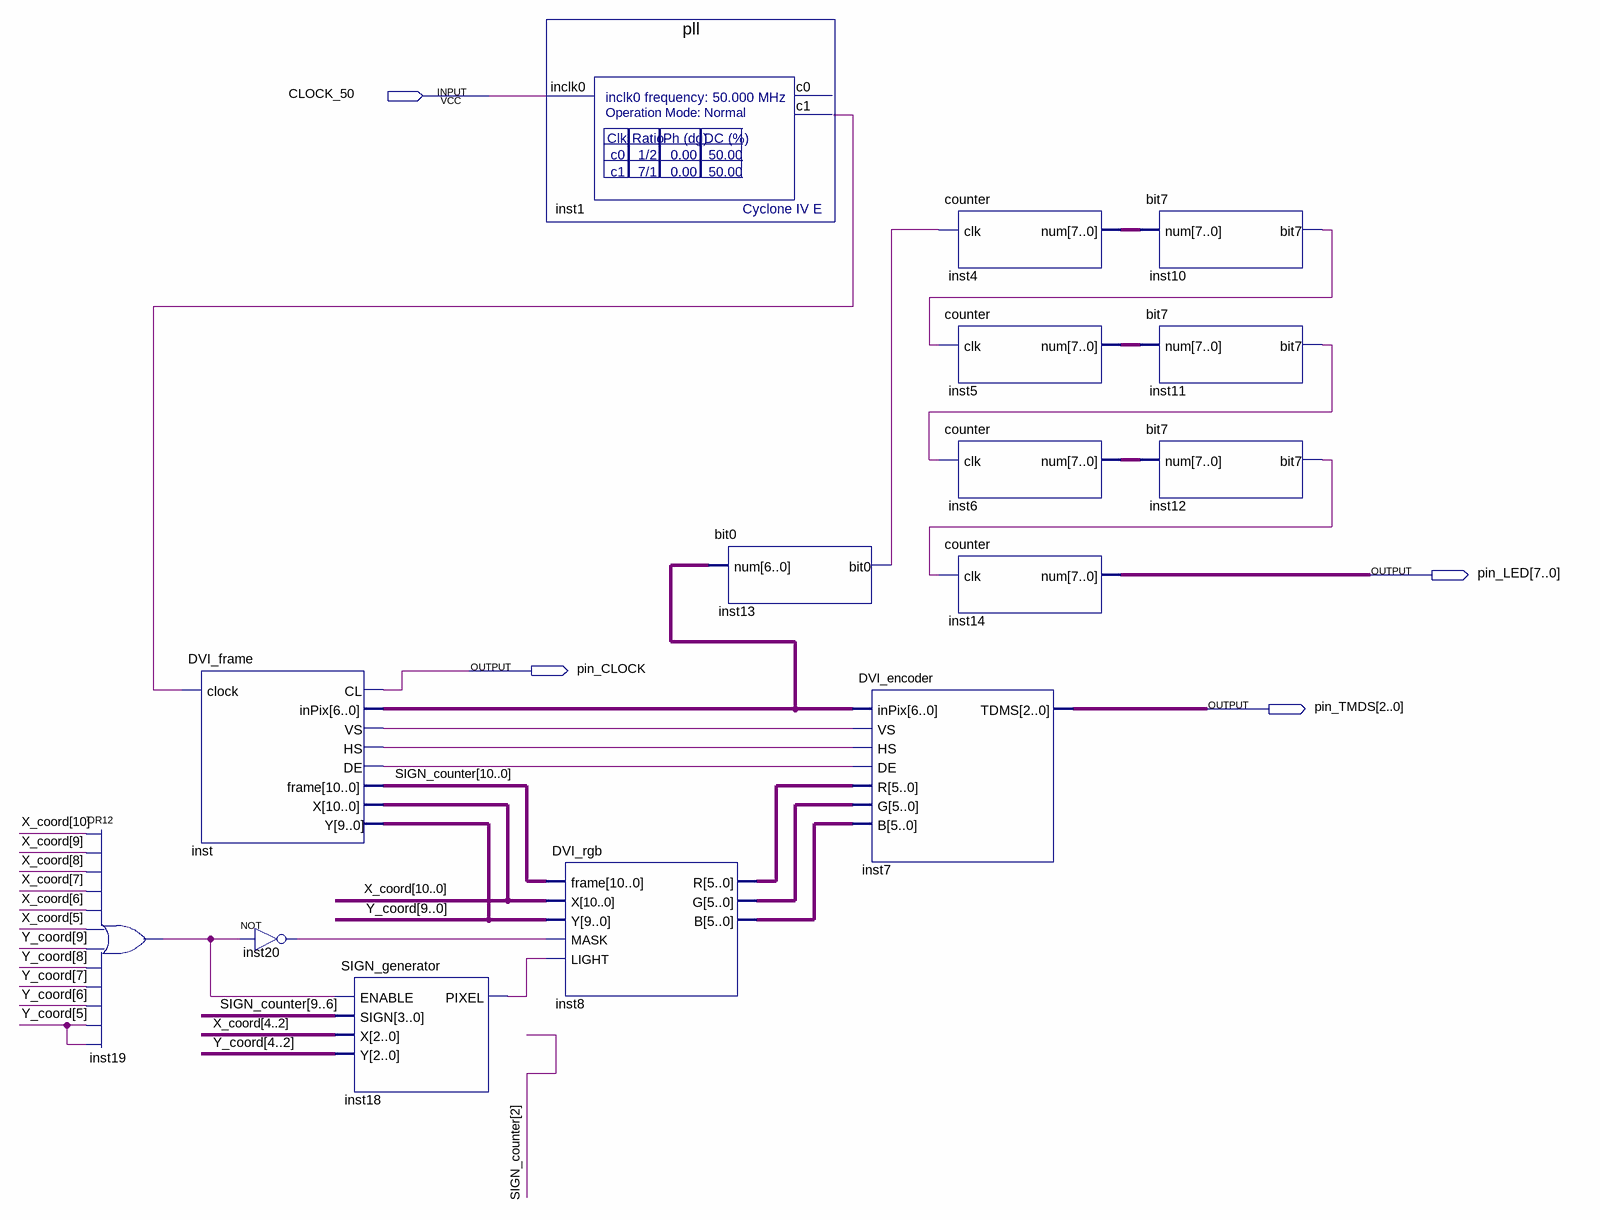
[diagram p0: schematic sheet]
// Quartus schematic test0.bdf as structural Verilog: 15 symbols, 4 pins
module test0 (
  input  CLOCK_50,
  output [7:0] pin_LED,
  output pin_CLOCK,
  output [2:0] pin_TMDS
);

  wire inst1_c1, inst10_bit7, inst11_bit7, inst12_bit7, inst13_bit0, inst18_pixel, inst19_out, inst20_out,
       inst_de, inst_hs, inst_vs;
  wire [5:0] inst8_b, inst8_g, inst8_r;
  wire [6:0] inst_inpix;
  wire [7:0] inst4_num, inst5_num, inst6_num;
  wire [9:0] Y_coord;
  wire [10:0] SIGN_counter, X_coord;

  or inst19 (inst19_out, X_coord[10], X_coord[9], X_coord[8], X_coord[7], X_coord[6], X_coord[5], Y_coord[9], Y_coord[8], Y_coord[7], Y_coord[6], Y_coord[5], Y_coord[5]);
  DVI_frame inst (
    .clock(inst1_c1), .CL(pin_CLOCK), .inPix(inst_inpix), .VS(inst_vs), .HS(inst_hs), .DE(inst_de),
    .frame(SIGN_counter), .X(X_coord), .Y(Y_coord));
  not inst20 (inst20_out, inst19_out);
  SIGN_generator inst18 (
    .ENABLE(inst19_out), .SIGN(SIGN_counter[9:6]), .X(X_coord[4:2]), .Y(Y_coord[4:2]), .PIXEL(inst18_pixel));
  pll inst1 (.inclk0(CLOCK_50), .c1(inst1_c1));  // open: c0
  DVI_rgb inst8 (
    .frame(SIGN_counter), .X(X_coord), .Y(Y_coord), .MASK(inst20_out), .LIGHT(inst18_pixel), .R(inst8_r),
    .G(inst8_g), .B(inst8_b));
  bit0 inst13 (.num(inst_inpix), .bit0(inst13_bit0));
  DVI_encoder inst7 (
    .inPix(inst_inpix), .VS(inst_vs), .HS(inst_hs), .DE(inst_de), .R(inst8_r), .G(inst8_g), .B(inst8_b),
    .TDMS(pin_TMDS));
  counter inst4 (.clk(inst13_bit0), .num(inst4_num));
  counter inst5 (.clk(inst10_bit7), .num(inst5_num));
  counter inst6 (.clk(inst11_bit7), .num(inst6_num));
  counter inst14 (.clk(inst12_bit7), .num(pin_LED));
  bit7 inst10 (.num(inst4_num), .bit7(inst10_bit7));
  bit7 inst11 (.num(inst5_num), .bit7(inst11_bit7));
  bit7 inst12 (.num(inst6_num), .bit7(inst12_bit7));
endmodule
